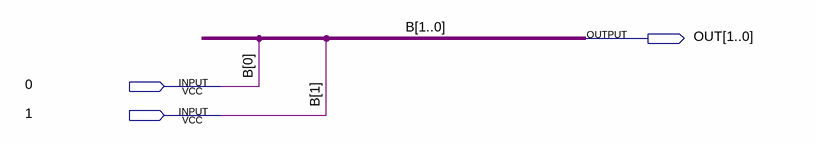
[diagram p0: schematic sheet]
// Quartus schematic BusConnector2.bdf as structural Verilog: 0 symbols, 3 pins
module BusConnector2 (
  input  \0 ,
  input  \1 ,
  output [1:0] OUT
);


  assign OUT = {\1 , \0 };

  // Other names for the same wires on the sheet: B[1:0] = {\1 , \0 }
endmodule
